# EAGLE schematic wavemeter_v1 (EAGLE 6.6.0)
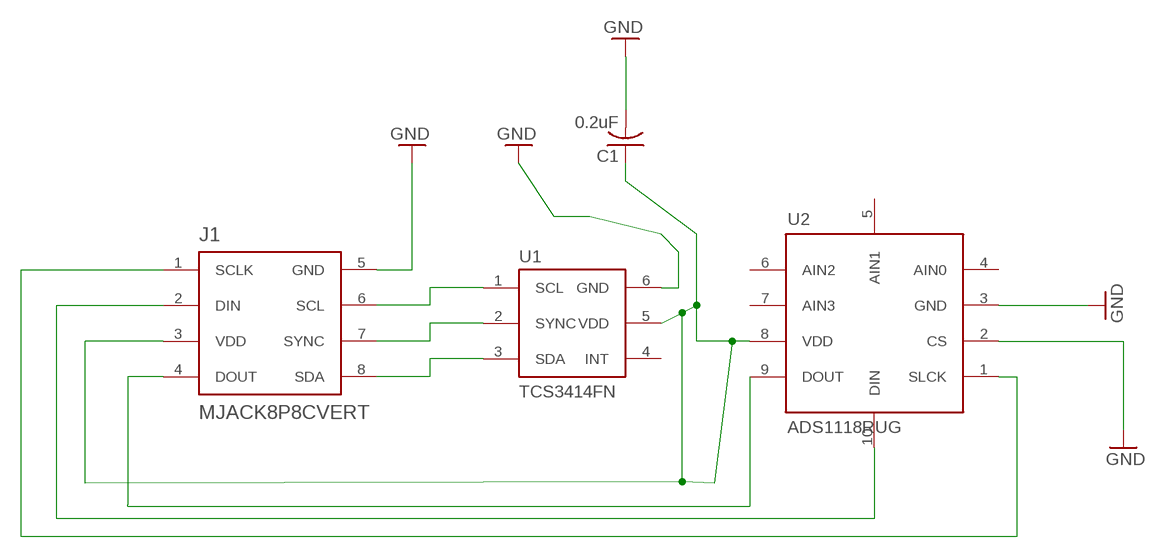
[diagram p0: schematic, sheet 1]

## Parts
C1  0.2uF  C-USC0603  [C0603]
J1  MJACK8P8CVERT  [MJACK8P8C]
U1  TCS3414FN  [TCS3414]
U2  ADS1118RUG  [ADS1118]

## Nets
GND: C1.2 J1.5(GND) U1.6(GND) U2.2(CS) U2.3(GND)
N$1: J1.6(SCL) U1.1(SCL)
N$2: J1.7(SYNC) U1.2(SYNC)
N$3: J1.8(SDA) U1.3(SDA)
N$4: C1.1 J1.3(VDD) U1.5(VDD) U2.8(VDD)
N$7: J1.4(DOUT) U2.9(DOUT)
N$8: J1.2(DIN) U2.10(DIN)
N$9: J1.1(SCLK) U2.1(SLCK)
Unconnected: U1.4(INT) U2.4(AIN0) U2.5(AIN1) U2.6(AIN2) U2.7(AIN3)

## Library data of the parts
C1 = resistor:C-US: CAPACITOR, American symbol
J1 = wavemeter:MJACK8P8C: Vertical Plastic 8P8C Modular Jack w/ Ears (Ethernet Jacks - Wurth Electronics - 615008144221)
U1 = wavemeter:TCS3414
U2 = wavemeter:ADS1118